# Altium schematic sheet MainBoard.SchDoc
size 594 x 420 mm; Scale: 1:1; DocumentType: Схема электрическая принципиальная; FirstReferrence: АБВГ.123456.001; PageSetup: Record=PageOptions|CenterHorizontal=True|CenterVertical=True|PrintScale=1.00|XCorrection=1.00|YCorrection=1.00|PrintKind=1|BorderSize=5000000|LeftOffset=0|BottomOffset=0|Orientation=2|PaperLength=1000|PaperWidth=1000|Scale=100|PaperSource=15|PrintQuality=1200|MediaType=1|DitherType=10|PaperKind=A3|PrintScaleMode=1; Weight: -; ScaleFactor: -
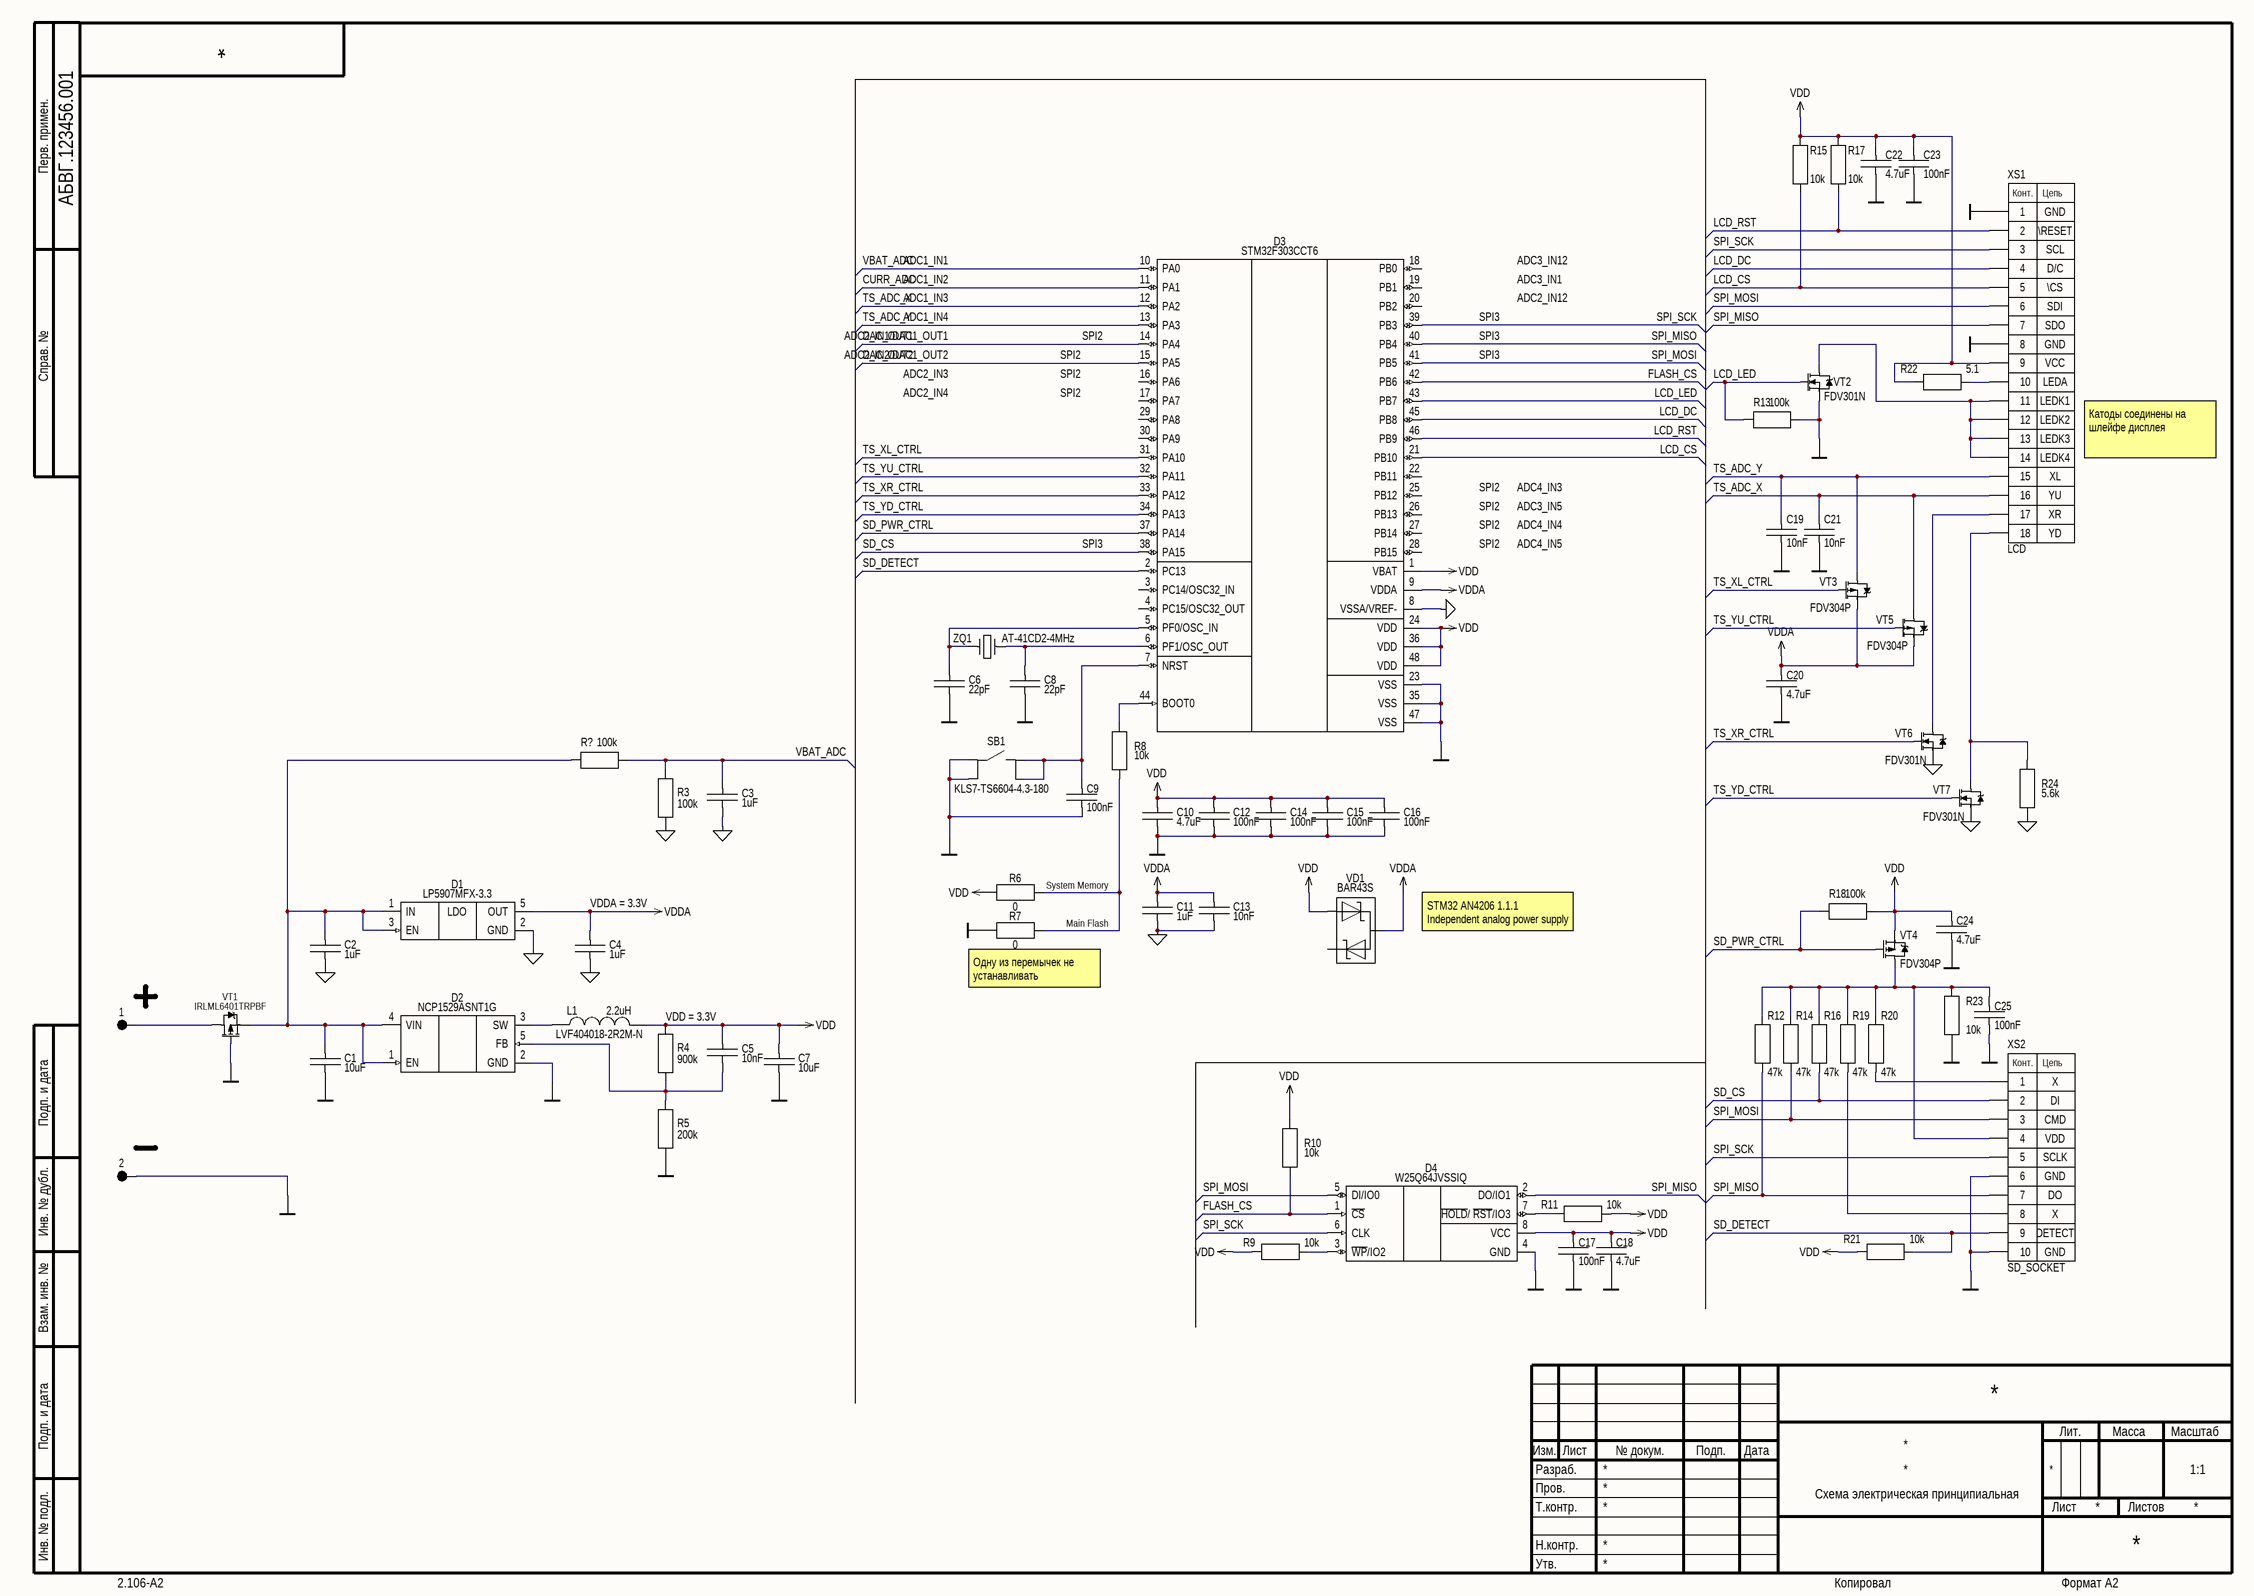
[diagram p0: MainBoard.SchDoc]

## Parts
1  TH Point  [TH0803]  (value not drawn)
2  TH Point  [TH0803]  (value not drawn)
C1  value 10uF  [CAP: 1206]  (hidden comment: C1206)
C2  value 1uF  [CAP: 1210]  (hidden comment: C1210)
C3  value 1uF  [CAP: 1210]  (hidden comment: C1210)
C4  value 1uF  [CAP: 1210]  (hidden comment: C1210)
C5  value 10nF  [CAP: 0603]  (hidden comment: C0603)
C6  value 22pF  [CAP: 0402]  (hidden comment: C0402)
C7  value 10uF  [CAP: 1206]  (hidden comment: C1206)
C8  value 22pF  [CAP: 0402]  (hidden comment: C0402)
C9  value 100nF  [CAP: 0603]  (hidden comment: C0603)
C10  value 4.7uF  [CAP: 0603]  (hidden comment: C0603)
C11  value 1uF  [CAP: 1210]  (hidden comment: C1210)
C12  value 100nF  [CAP: 0603]  (hidden comment: C0603)
C13  value 10nF  [CAP: 0603]  (hidden comment: C0603)
C14  value 100nF  [CAP: 0603]  (hidden comment: C0603)
C15  value 100nF  [CAP: 0603]  (hidden comment: C0603)
C16  value 100nF  [CAP: 0603]  (hidden comment: C0603)
C17  value 100nF  [CAP: 0603]  (hidden comment: C0603)
C18  value 4.7uF  [CAP: 0603]  (hidden comment: C0603)
C19  value 10nF  [CAP: 0603]  (hidden comment: C0603)
C20  value 4.7uF  [CAP: 0603]  (hidden comment: C0603)
C21  value 10nF  [CAP: 0603]  (hidden comment: C0603)
C22  value 4.7uF  [CAP: 0603]  (hidden comment: C0603)
C23  value 100nF  [CAP: 0603]  (hidden comment: C0603)
C24  value 4.7uF  [CAP: 0603]  (hidden comment: C0603)
C25  value 100nF  [CAP: 0603]  (hidden comment: C0603)
D1  ManufacturerPartNumber: LP5907MFX-3.3  [SOT23-5]  (hidden comment: LP5907)
D2  ManufacturerPartNumber: NCP1529ASNT1G  [SOT23-5]  (hidden comment: NCP1529)
D3  ManufacturerPartNumber: STM32F303CCT6  [LQFP48]  (hidden comment: STM32F303)
D4  ManufacturerPartNumber: W25Q64JVSSIQ  [8-SOIC 208-MIL]  (hidden comment: W25Q64JV)
L1  value 2.2uH  ManufacturerPartNumber: LVF404018-2R2M-N  [IND: LVF404018]  (hidden comment: LVF404018)
R3  value 100k  [RES: 0603]  (hidden comment: R0603)
R4  value 900k  [RES: 0603]  (hidden comment: R0603)
R5  value 200k  [RES: 0603]  (hidden comment: R0603)
R6  value 0  [RES: 0805]  (hidden comment: R0805)
R7  value 0  [RES: 0805]  (hidden comment: R0805)
R8  value 10k  [RES: 0603]  (hidden comment: R0603)
R9  value 10k  [RES: 0603]  (hidden comment: R0603)
R10  value 10k  [RES: 0603]  (hidden comment: R0603)
R11  value 10k  [RES: 0603]  (hidden comment: R0603)
R12  value 47k  [RES: 0603]  (hidden comment: R0603)
R13  value 100k  [RES: 0603]  (hidden comment: R0603)
R14  value 47k  [RES: 0603]  (hidden comment: R0603)
R15  value 10k  [RES: 0603]  (hidden comment: R0603)
R16  value 47k  [RES: 0603]  (hidden comment: R0603)
R17  value 10k  [RES: 0603]  (hidden comment: R0603)
R18  value 100k  [RES: 0603]  (hidden comment: R0603)
R19  value 47k  [RES: 0603]  (hidden comment: R0603)
R20  value 47k  [RES: 0603]  (hidden comment: R0603)
R21  value 10k  [RES: 0603]  (hidden comment: R0603)
R22  value 5.1  [RES: 0603]  (hidden comment: R0603)
R23  value 10k  [RES: 0603]  (hidden comment: R0603)
R24  value 5.6k  [RES: 0603]  (hidden comment: R0603)
R?  value 100k  [RES: 0603]  (hidden comment: R0603)
SB1  ManufacturerPartNumber: KLS7-TS6604-4.3-180  [BTN: KLS7-TS6604-4.3-180]  (hidden comment: KLS7-TS6604)
VD1  BAR43S  [SOT23]
VT1  ManufacturerPartNumber: IRLML6401TRPBF  [SOT23]  (hidden comment: IRLML6401)
VT2  FDV301N  [SOT23]
VT3  FDV304P  [SOT23]
VT4  FDV304P  [SOT23]
VT5  FDV304P  [SOT23]
VT6  FDV301N  [SOT23]
VT7  FDV301N  [SOT23]
XS1  LCD  PIN9: VCC  PIN8: GND  PIN7: SDO  PIN6: SDI  PIN5: \CS  PIN4: D/C  PIN3: SCL  PIN2: \RESET  PIN17: XR  PIN18: YD  PIN16: YU  PIN14: LEDK4  PIN15: XL  PIN12: LEDK2  PIN13: LEDK3  PIN11: LEDK1  PIN10: LEDA  [LCD]
XS2  SD_SOCKET  PIN3: CMD  PIN5: SCLK  PIN4: VDD  PIN6: GND  PIN7: DO  PIN8: X  PIN9: DETECT  PIN2: DI  [CON: SD_SOCKET]
ZQ1  ManufacturerPartNumber: AT-41CD2-4MHz  [XTAL: HC-49SM]  (hidden comment: AT-41CD2)

## Nets
AGND: C2.2 C3.2 C4.2 C11.2 C13.2 D1.2(GND) D3.8(VSSA/VREF-) R3.2 R24.1 VT6.2(S) VT7.2(S)
GND: 2.1 C1.2 C6.2 C7.2 C8.2 C9.2 C10.2 C12.2 C14.2 C15.2 C16.2 C17.2 C18.2 C19.2 C20.2 C21.2 C22.2 C23.2 C24.2 C25.2 D2.2(GND) D3.23(VSS) D3.35(VSS) D3.47(VSS) D4.4(GND) R5.2 R7.1 R13.2 R23.1 SB1.1 SB1.2 VT1.1(G) VT2.2(S) XS1.1 XS1.8 XS2.6 XS2.10
VDD: C5.1 C7.1 C10.1 C12.1 C14.1 C15.1 C16.1 C17.1 C18.1 C22.1 C23.1 C24.1 D3.1(VBAT) D3.24(VDD) D3.36(VDD) D3.48(VDD) D4.8(VCC) L1.1 R4.1 R6.1 R9.2 R10.2 R11.1 R15.2 R17.2 R18.2 R21.1 R22.1 VD1.1 VT4.2(S) XS1.9
VDDA: C4.1 C11.1 C13.1 C20.1 D1.5(OUT) D3.9(VDDA) VD1.3 VT3.2(S) VT5.2(S)
CURR_ADC: D3.11(PA1)
DAC_OUT1: D3.14(PA4)
DAC_OUT2: D3.15(PA5)
FLASH_CS: D3.42(PB6) D4.1(~{CS}) R10.1
LCD_CS: D3.21(PB10) R15.1 XS1.5
LCD_DC: D3.45(PB8) XS1.4
LCD_LED: D3.43(PB7) R13.1 VT2.1(G)
LCD_RST: D3.46(PB9) R17.1 XS1.2
SD_CS: D3.38(PA15) R16.1 XS2.2
SD_DETECT: D3.2(PC13) R21.2 XS2.9
SD_PWR_CTRL: D3.37(PA14) R18.1 VT4.1(G)
SPI_MISO: D3.40(PB4) D4.2(DO/IO1) R12.1 XS1.7 XS2.7
SPI_MOSI: D3.41(PB5) D4.5(DI/IO0) R14.1 XS1.6 XS2.3
SPI_SCK: D3.39(PB3) D4.6(CLK) XS1.3 XS2.5
TS_ADC_X: C21.1 D3.12(PA2) VT5.3(D) XS1.16
TS_ADC_Y: C19.1 D3.13(PA3) VT3.3(D) XS1.15
TS_XL_CTRL: D3.31(PA10) VT3.1(G)
TS_XR_CTRL: D3.33(PA12) VT6.1(G)
TS_YD_CTRL: D3.34(PA13) VT7.1(G)
TS_YU_CTRL: D3.32(PA11) VT5.1(G)
VBAT_ADC: C3.1 D3.10(PA0) R3.1 R?.2
Net1_1: 1.1 VT1.3(D)
NetC1_1: C1.1 C2.1 D1.1(IN) D1.3(EN) D2.1(EN) D2.4(VIN) R?.1 VT1.2(S)
NetC5_2: C5.2 D2.5(FB) R4.2 R5.1
NetC6_1: C6.1 D3.5(PF0/OSC_IN) ZQ1.2
NetC8_1: C8.1 D3.6(PF1/OSC_OUT) ZQ1.1
NetC9_1: C9.1 D3.7(NRST) SB1.3 SB1.4
NetC25_1: C25.1 R12.2 R14.2 R16.2 R19.2 R20.2 R23.2 VT4.3(D) XS2.4
NetD2_3: D2.3(SW) L1.2
NetD3_44: D3.44(BOOT0) R8.2
NetD4_3: D4.3(~{WP}/IO2) R9.1
NetD4_7: D4.7(~{HOLD}/_~{RST}/IO3) R11.2
NetR6_2: R6.2 R7.2 R8.1
NetR19_1: R19.1 XS2.8
NetR20_1: R20.1 XS2.1
NetR22_2: R22.2 XS1.10
NetR24_2: R24.2 VT7.3(D) XS1.18
NetVT2_3: VT2.3(D) XS1.11 XS1.12 XS1.13 XS1.14
NetVT6_3: VT6.3(D) XS1.17

Not connected (* = marked no-connect by the designer): D3 3(PC14/OSC32_IN) 4(PC15/OSC32_OUT) 16(PA6) 17(PA7) 18(PB0) 19(PB1) 20(PB2) 22(PB11) 25(PB12) 26(PB13) 27(PB14) 28(PB15) 29(PA8) 30(PA9); VD1 2

## Notes on the sheet
- ADC1_IN1
- ADC3_IN12
- ADC1_IN2
- ADC1_IN3
- ADC3_IN1
- ADC2_IN12
- ADC1_IN4
- ADC2_IN1/DAC1_OUT1
- ADC2_IN2/DAC1_OUT2
- SPI2
- SPI3
- ADC2_IN3
- ADC2_IN4
- Катоды соединены на шлейфе дисплея
- ADC4_IN3
- ADC3_IN5
- ADC4_IN4
- ADC4_IN5
- (near R6) System Memory
- (near C4) VDDA = 3.3V
- Main Flash
- STM32 AN4206 1.1.1 Independent analog power supply
- (near R7) Одну из перемычек не устанавливать
- (near R4) VDD = 3.3V
- Перв. примен.
- Справ. №
- Подп. и дата
- Инв. № дубл.
- Взам. инв. №
- Разраб.
- Изм.
- Лист
- № докум.
- Подп.
- Дата
- Лит.
- Масса
- Масштаб
- Пров.
- Т.контр.
- Листов
- Инв. № подл.
- Утв.
- Н.контр.
- 2.106-A2
- Копировал
- Формат А2
- (in symbol LCD) Конт.; Цепь
- (in symbol LP5907) LDO
- (in symbol SD_SOCKET) Конт.; Цепь

## Library data of the parts
1 2 = TH Point: Through Hole Soldering Point
C1 C7 = C1206: Capacitor SMD; Tolerance: ±10%; TKE: X5R; Voltage: 16V; Case: 1206; Height: *
C2-C4 C11 = C1210: Capacitor SMD; Tolerance: ±10%; TKE: X7R; Voltage: 50V; Case: 1210; Height: *
C5 C13 C19 C21 = C0603: Capacitor SMD; Tolerance: ±10%; TKE: X7R; Voltage: 100V; Case: 0603; Height: *
C6 C8 = C0402: Capacitor SMD; Tolerance: ±5%; TKE: NPO; Voltage: 50V; Case: 0402; Height: *
C9 C12 C14-C17 C23 C25 = C0603: Capacitor SMD; Tolerance: ±10%; TKE: X7R; Voltage: 16V; Case: 0603; Height: *
C10 C18 C20 C22 C24 = C0603: Capacitor SMD; Tolerance: ±10%; TKE: X5R; Voltage: 6.3V; Case: 0603; Height: *
D1 = LP5907: LDO Ultra-Low-Noise; Manufacturer: Texas Instruments; ComponentLink1Description: Datasheet; ComponentLink1URL: https://www.ti.com/lit/gpn/lp5907; ComponentLink2Description: Supplier; ComponentLink2URL: https://www.chipdip.ru/product/lp5907mfx-3.3-nopb; Case: SOT23-5
D2 = NCP1529: Buck Converter; Manufacturer: ON Semiconductor; ComponentLink1Description: Datasheet; ComponentLink1URL: https://www.onsemi.com/pub/Collateral/NCP1529-D.PDF; Case: TSOP−5 (SOT23-5); ComponentLink2Description: Supplier; ComponentLink2URL: https://www.chipdip.ru/product/ncp1529asnt1g
D3 = STM32F303: ARM Cortex-M4 MCU; Manufacturer: STMicroelectronics; ComponentLink1Description: Datasheet; ComponentLink1URL: https://www.st.com/resource/en/datasheet/stm32f303cc.pdf; Case: LQFP-48 (7x7x1.4)
D4 = W25Q64JV: Serial Flash Memory 64Mb; Manufacturer: Winbond; ComponentLink1Description: Datasheet; ComponentLink1URL: https://www.winbond.com/resource-files/w25q64jv%20revj%2003272018%20plus.pdf; Case: SOIC-8 (208-mil)
L1 = LVF404018: Inductor SMD; RDC: 0.0470; Tolerance: ±20%; SaturationCurrent: 2.7A; Case: LVF404018
R3-R5 R8-R12 R14-R17 R19 R20 R23 R24 = R0603: Resistor SMD; Power: 0.1W; Tolerance: ±1%; Case: 0603
R6 R7 = R0805: Resistor SMD; Power: 0.125W; Tolerance: ±5%; Case: 0805
R13 R18 R21 R22 R? = R0603: Resistor SMD; Power: 0.1W; Tolerance: ±5%; Case: 0603
SB1 = KLS7-TS6604: Tactile Button SMD; Height: 4.3mm; Manufacturer: *
VD1 = BAR43S: Schottky Rectifier Double 30V 0.2A; Manufacturer: ON Semiconductor; ComponentLink1Description: Datasheet; ComponentLink1URL: https://www.onsemi.com/pub/Collateral/BAR43S-D.pdf; ComponentLink2Description: Supplier; ComponentLink2URL: https://www.chipdip.ru/product/bar43s; Case: SOT23; ManufacturerPartNumber: BAR43S
VT1 = IRLML6401: PMOS 4.3A 50mOhm; Manufacturer: Infineon; Case: SOT23; ComponentLink1Description: Datasheet; ComponentLink1URL: https://www.infineon.com/dgdl/irlml6401pbf.pdf?fileId=5546d462533600a401535668b96d2634; ComponentLink2Description: Supplier; ComponentLink2URL: https://www.chipdip.ru/product/irlml6401tr
VT2 VT6 VT7 = FDV301N: NMOS 0.22A 25V 4Ohm; Manufacturer: ON Semiconductor; Case: SOT23; ComponentLink1Description: Datasheet; ComponentLink1URL: https://www.onsemi.com/pub/Collateral/FDV301N-D.PDF; ComponentLink2Description: Supplier; ComponentLink2URL: https://www.chipdip.ru/product/fdv301n-2; ManufacturerPartNumber: FDV301N
VT3-VT5 = FDV304P: PMOS 0.46A 25V 1.1Ohm; Manufacturer: ON Semiconductor; Case: SOT23; ComponentLink1Description: Datasheet; ComponentLink1URL: https://www.onsemi.com/pub/Collateral/FDV304P-D.PDF; ComponentLink2Description: Supplier; ComponentLink2URL: https://www.chipdip.ru/product/fdv304p-2; ManufacturerPartNumber: FDV304P
XS1 = LCD: LCD Soldering Connector; ComponentLink1Description: Supplier; ComponentLink1URL: https://ru.aliexpress.com/item/32951689204.html; PIN1: GND
XS2 = SD_SOCKET: MicroSD Card Connector; ManufacturerPartNumber: TFP09-2-12B; ComponentLink1Description: Supplier; ComponentLink1URL: https://ru.aliexpress.com/item/4000129510556.html; PIN10: GND; PIN1: X
ZQ1 = AT-41CD2: Manufacturer: NDK; LoadCapacitance: 16pF; Case: HC-49SM; ComponentLink1Description: Datasheet; ComponentLink1URL: https://www.ndk.com/images/products/catalog/c_AT-41_e.pdf; ComponentLink2Description: Supplier; ComponentLink2URL: https://www.chipdip.ru/product0/9000523943